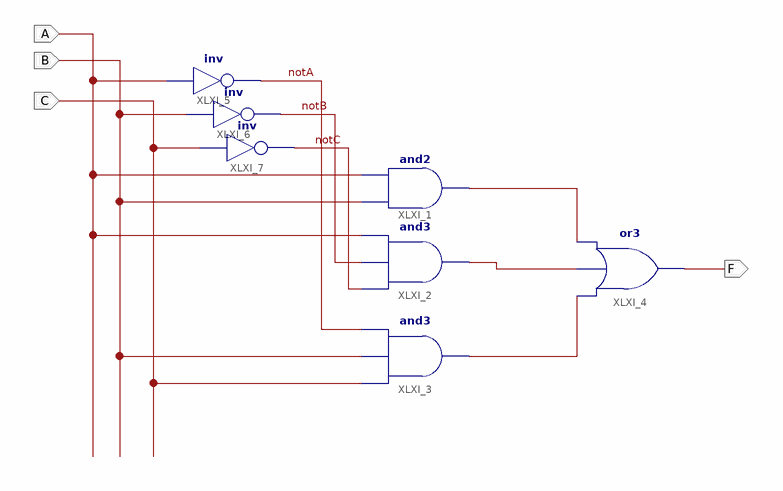
[diagram p0: schematic sheet 1]
// Xilinx ISE schematic main.sch (spartan6) as structural Verilog: 7 symbols, 4 ports
module main (
  input  A,
  input  B,
  input  C,
  output F
);

  wire notA, notB, notC, XLXN_1, XLXN_2, XLXN_3;

  not XLXI_5 (notA, A);
  not XLXI_6 (notB, B);
  not XLXI_7 (notC, C);
  and XLXI_1 (XLXN_1, B, A);
  and XLXI_2 (XLXN_2, notC, notB, A);
  and XLXI_3 (XLXN_3, C, B, notA);
  or XLXI_4 (F, XLXN_3, XLXN_2, XLXN_1);
endmodule
